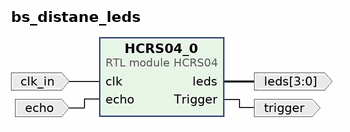
[diagram p0: block diagram of the top level]
# Vivado block design bs_distane_leds, xc7z020clg400-1, Vivado 2022.1
create_bd_design bs_distane_leds

create_bd_port -dir I -type clk clk_in
set_property -dict {CONFIG.FREQ_HZ 125000000} [get_bd_ports clk_in]
create_bd_port -dir I echo
create_bd_port -dir O trigger
create_bd_port -dir O -from 3 -to 0 leds

create_bd_cell -type module -reference HCRS04 HCRS04_0

# ---- connections ----

connect_bd_net [get_bd_pins HCRS04_0/Trigger] [get_bd_ports trigger]
connect_bd_net [get_bd_pins HCRS04_0/leds] [get_bd_ports leds]
connect_bd_net [get_bd_ports clk_in] [get_bd_pins HCRS04_0/clk]
connect_bd_net [get_bd_ports echo] [get_bd_pins HCRS04_0/echo]

validate_bd_design
save_bd_design
